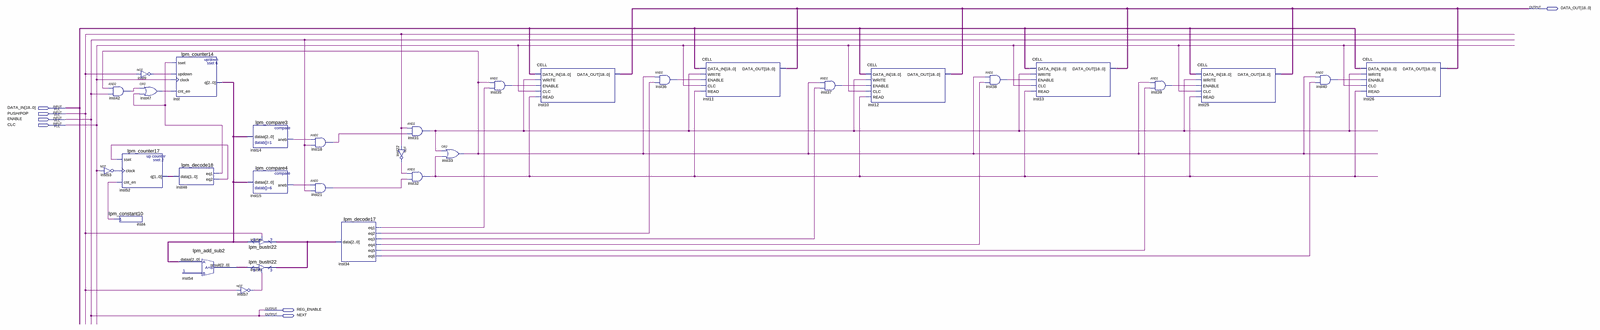
[diagram p0: schematic sheet, whole]
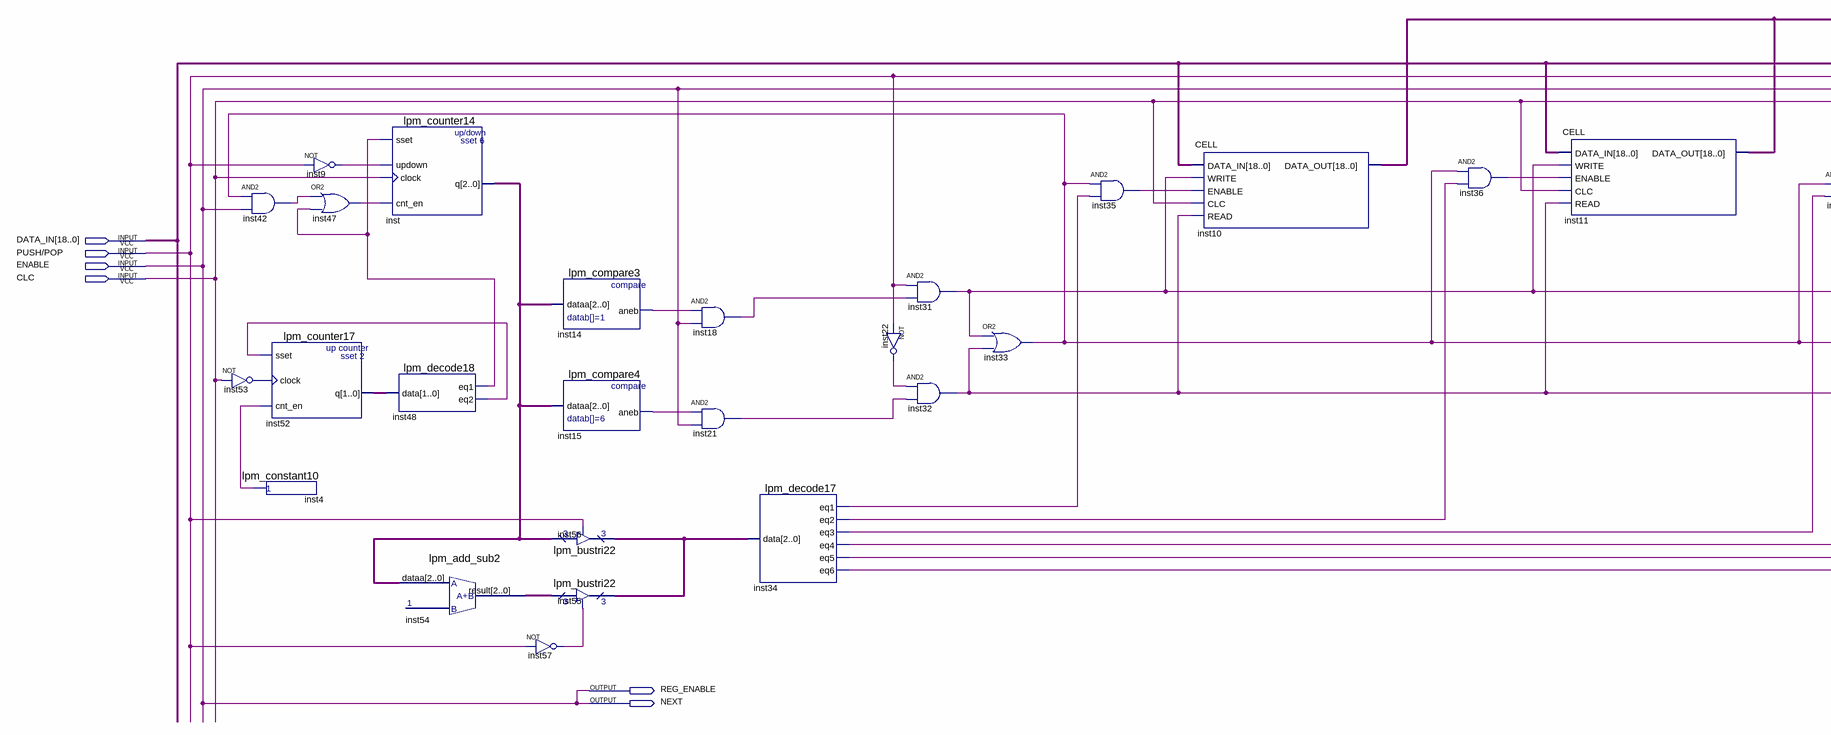
[diagram p1: schematic sheet, left part]
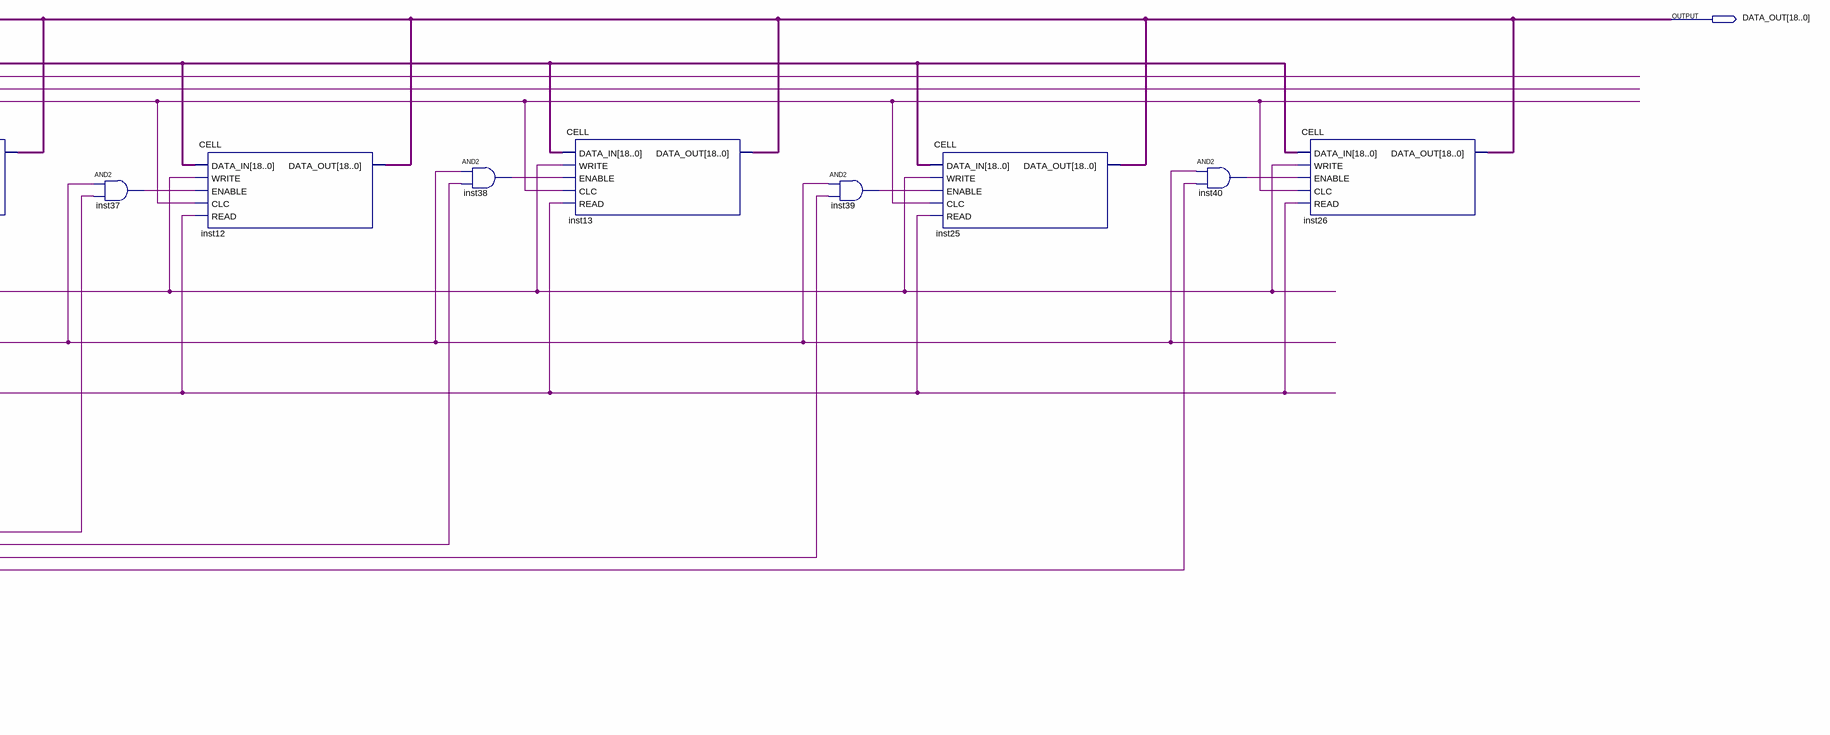
[diagram p2: schematic sheet, right part]
// Quartus schematic STACK.bdf as structural Verilog: 33 symbols, 7 pins
module STACK (
  input  [18:0] DATA_IN,
  input  \PUSH/POP ,
  input  ENABLE,
  input  CLC,
  output [18:0] DATA_OUT,
  output REG_ENABLE,
  output NEXT
);

  wire inst4_result, inst9_out, inst14_aneb, inst15_aneb, inst18_out, inst21_out, inst22_out, inst31_out,
       inst32_out, inst33_out, inst34_eq1, inst34_eq2, inst34_eq3, inst34_eq4, inst34_eq5, inst34_eq6,
       inst35_out, inst36_out, inst37_out, inst38_out, inst39_out, inst40_out, inst42_out, inst47_out,
       inst48_eq1, inst48_eq2, inst53_out, inst57_out;
  wire [1:0] inst52_q;
  wire [2:0] inst54_result, inst56_tridata, inst_q;

  and inst42 (inst42_out, inst33_out, ENABLE);
  not inst53 (inst53_out, CLC);
  lpm_counter17 inst52 (.sset(inst48_eq2), .clock(inst53_out), .cnt_en(inst4_result), .q(inst52_q));
  lpm_constant10 inst4 (.result(inst4_result));
  not inst9 (inst9_out, \PUSH/POP );
  or inst47 (inst47_out, inst42_out, inst48_eq1);
  lpm_counter14 inst (.sset(inst48_eq1), .updown(inst9_out), .clock(CLC), .cnt_en(inst47_out), .q(inst_q));
  lpm_decode18 inst48 (.data(inst52_q), .eq1(inst48_eq1), .eq2(inst48_eq2));
  lpm_add_sub2 inst54 (.dataa(inst_q), .result(inst54_result));
  lpm_compare3 inst14 (.dataa(inst_q), .aneb(inst14_aneb));
  lpm_compare4 inst15 (.dataa(inst_q), .aneb(inst15_aneb));
  lpm_bustri22 inst56 (.enabledt(\PUSH/POP ), .data(inst_q), .tridata(inst56_tridata));
  lpm_bustri22 inst55 (.enabledt(inst57_out), .data(inst54_result), .tridata(inst56_tridata));
  not inst57 (inst57_out, \PUSH/POP );
  and inst18 (inst18_out, inst14_aneb, ENABLE);
  and inst21 (inst21_out, inst15_aneb, ENABLE);
  lpm_decode17 inst34 (
    .data(inst56_tridata), .eq1(inst34_eq1), .eq2(inst34_eq2), .eq3(inst34_eq3), .eq4(inst34_eq4),
    .eq5(inst34_eq5), .eq6(inst34_eq6));
  and inst31 (inst31_out, \PUSH/POP , inst18_out);
  not inst22 (inst22_out, \PUSH/POP );
  and inst32 (inst32_out, inst22_out, inst21_out);
  or inst33 (inst33_out, inst31_out, inst32_out);
  and inst35 (inst35_out, inst33_out, inst34_eq1);
  CELL inst10 (
    .DATA_IN(DATA_IN), .WRITE(inst31_out), .ENABLE(inst35_out), .CLC(CLC), .READ(inst32_out),
    .DATA_OUT(DATA_OUT));
  and inst36 (inst36_out, inst33_out, inst34_eq2);
  CELL inst11 (
    .DATA_IN(DATA_IN), .WRITE(inst31_out), .ENABLE(inst36_out), .CLC(CLC), .READ(inst32_out),
    .DATA_OUT(DATA_OUT));
  and inst37 (inst37_out, inst33_out, inst34_eq3);
  CELL inst12 (
    .DATA_IN(DATA_IN), .WRITE(inst31_out), .ENABLE(inst37_out), .CLC(CLC), .READ(inst32_out),
    .DATA_OUT(DATA_OUT));
  and inst38 (inst38_out, inst33_out, inst34_eq4);
  CELL inst13 (
    .DATA_IN(DATA_IN), .WRITE(inst31_out), .ENABLE(inst38_out), .CLC(CLC), .READ(inst32_out),
    .DATA_OUT(DATA_OUT));
  and inst39 (inst39_out, inst33_out, inst34_eq5);
  CELL inst25 (
    .DATA_IN(DATA_IN), .WRITE(inst31_out), .ENABLE(inst39_out), .CLC(CLC), .READ(inst32_out),
    .DATA_OUT(DATA_OUT));
  and inst40 (inst40_out, inst33_out, inst34_eq6);
  CELL inst26 (
    .DATA_IN(DATA_IN), .WRITE(inst31_out), .ENABLE(inst40_out), .CLC(CLC), .READ(inst32_out),
    .DATA_OUT(DATA_OUT));

  assign NEXT = ENABLE;
  assign REG_ENABLE = ENABLE;
endmodule
